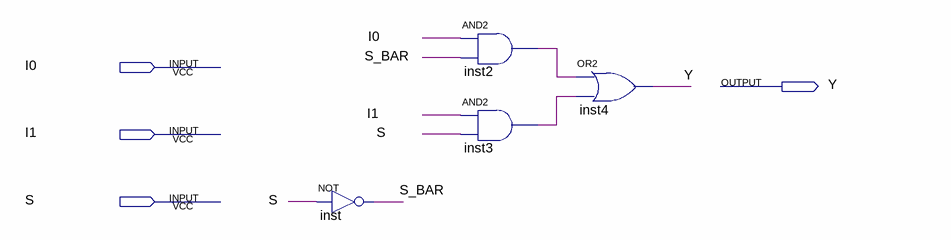
[diagram p0: schematic sheet]
// Quartus schematic two_multiply_one_mux.bdf as structural Verilog: 4 symbols, 4 pins
module two_multiply_one_mux (
  input  I0,
  input  I1,
  input  S,
  output Y
);

  wire inst2_out, inst3_out, S_BAR;

  not inst (S_BAR, S);
  and inst2 (inst2_out, I0, S_BAR);
  and inst3 (inst3_out, I1, S);
  or inst4 (Y, inst2_out, inst3_out);
endmodule
